# Altium schematic sheet Scratchpad.SchDoc (part 2 of 3)
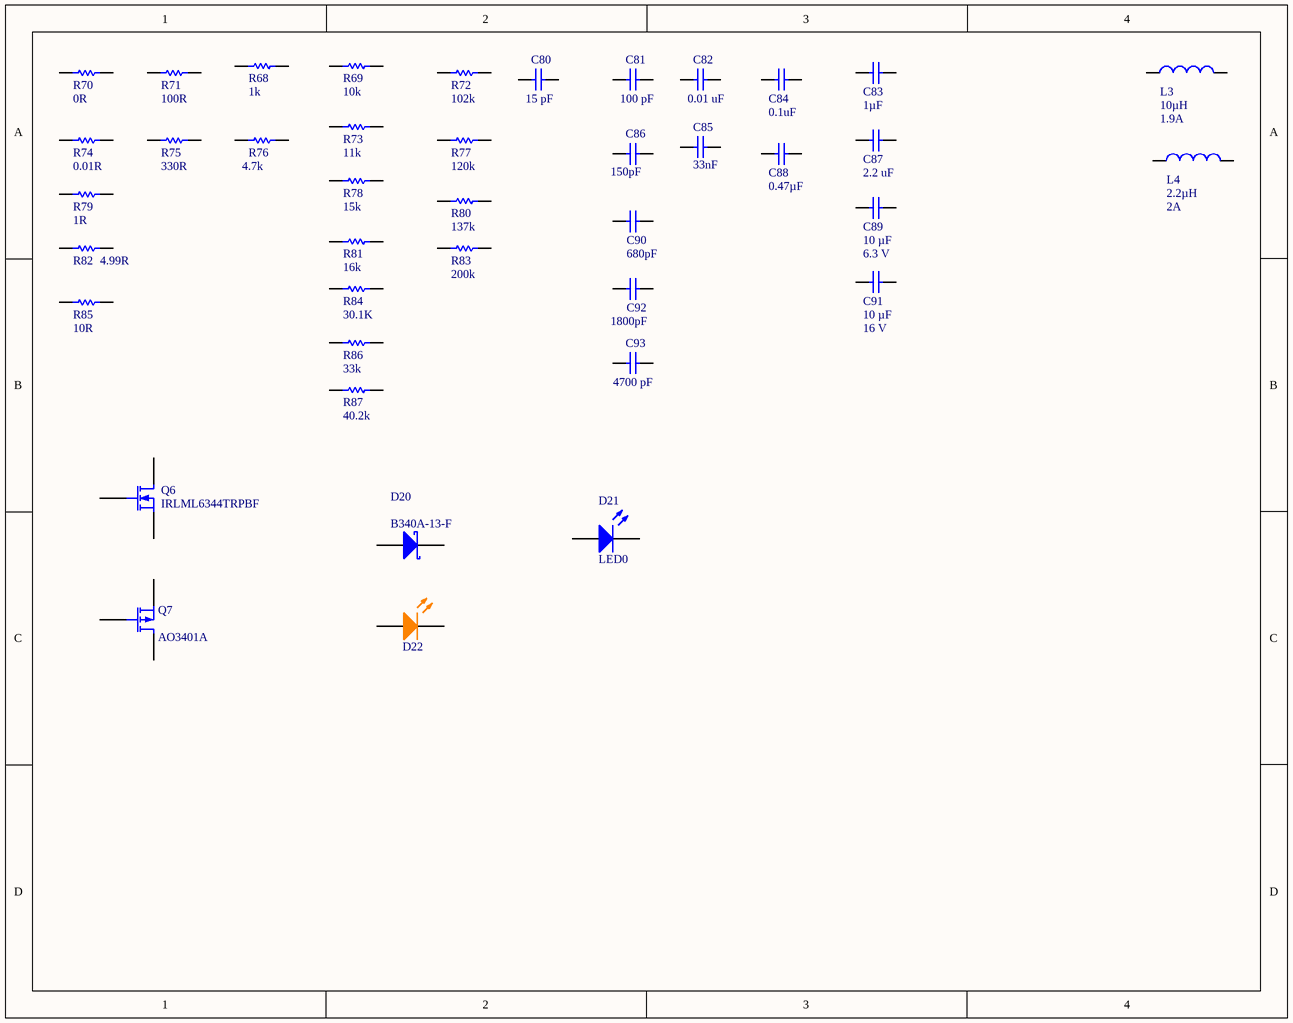
[diagram p1: Scratchpad.SchDoc]
## Library data of the parts
C80 = Cap: CAP .1UF 50V CERAMIC Y5V 0805; Manufacturer: Johanson; Manufacturer Part Number: 500R07N150JV4T; Description1: Cap Ceramic 15pF 50V C0G 5% SMD 0402 125C Paper T/R; Voltage Rating DC: 50 VDC; Dielectric: C0G (NP0); Tolerance: 5 %; Brand: Johanson Dielectrics; Type: Surface Mount MLCC; Revision: July-2002: Re-released for DXP Platform.; Supplier 1: Digi-Key; Supplier Part Number 1: 709-1118-1-ND; Stock 1: 100000; Pricing 1: 1=0.14, 10=0.103, 100=0.0458, 500=0.0327, 1000=0.0257, 2500=0.0233, 5000=0.0215 (USD); Product Category: Multilayer Ceramic Capacitors MLCC - SMD/SMT; RoHS: Details; Maximum Operating Temperature: + 125 C; Minimum Operating Temperature: - 55 C; Product: General Type MLCCs; Packaging: Reel; Factory Pack Quantity: 10000; ComponentLink1URL: https://datasheet.ciiva.com/26934/getdatasheetpartid-85139-26934162.pdf; ComponentLink1Description: https://datasheet.ciiva.com/26934/getdatasheetpartid-85139-26934162.pdf
C81 = Cap: CAP .1UF 50V CERAMIC Y5V 0805; Manufacturer: Kyocera AVX; Manufacturer Part Number: 04023C101KAT2A; Description1: Multilayer Ceramic Capacitors MLCC - SMD/SMT 0402 100pF 25volts X7R 10%; Dielectric: X7R; Tolerance (%): ±10 %; Rated Voltage: 25 V; Revision: July-2002: Re-released for DXP Platform.; Supplier 1: Digi-Key; Supplier Part Number 1: 478-10080-1-ND; Stock 1: 0; Pricing 1: 1=0.1, 10=0.041, 100=0.0183, 500=0.0131, 1000=0.0103, 2500=0.0093, 5000=0.0086 (USD); Case Size/Dimension: 0402; ComponentLink1URL: https://datasheet.ciiva.com/5416/cx7r-5416597.pdf; ComponentLink1Description: https://datasheet.ciiva.com/5416/cx7r-5416597.pdf; ComponentLink2URL: https://datasheet.ciiva.com/28453/1679506-28453671.pdf; ComponentLink2Description: https://datasheet.ciiva.com/28453/1679506-28453671.pdf; ComponentLink3URL: https://datasheet.ciiva.com/22619/1679506-22619705.pdf; ComponentLink3Description: https://datasheet.ciiva.com/22619/1679506-22619705.pdf; ComponentLink4URL: https://datasheet.ciiva.com/206/cx7r-206426.pdf; ComponentLink4Description: https://datasheet.ciiva.com/206/cx7r-206426.pdf; ComponentLink5URL: https://datasheet.ciiva.com/16397/cx7r-16397643.pdf; ComponentLink5Description: https://datasheet.ciiva.com/16397/cx7r-16397643.pdf; ComponentLink6URL: https://datasheet.ciiva.com/28586/1679506-28586543.pdf; ComponentLink6Description: https://datasheet.ciiva.com/28586/1679506-28586543.pdf
C82 = Cap: CAP .1UF 50V CERAMIC Y5V 0805; Manufacturer: American Technical Ceramics; Manufacturer Part Number: 520L103KT16T; Part # Aliases: 520L103KT ATC520L103KT ATC520L103KT16T; Description1: Multilayer Ceramic Capacitors MLCC - SMD/SMT 16volts 0.01uF 10%; Voltage Rating DC: 16 VDC; Dielectric: X7R; Tolerance: 10 %; Brand: American Technical Ceramics (ATC); Type: Broadband Multilayer Capacitor; Revision: July-2002: Re-released for DXP Platform.; Supplier 1: Digi-Key; Supplier Part Number 1: 1284-1540-1-ND; Stock 1: 206115; Pricing 1: 1=0.98, 10=0.748, 100=0.535 (USD); Product Category: Multilayer Ceramic Capacitors MLCC - SMD/SMT; RoHS: Details; Case Code - in: 0402; Case Code - mm: 1005; Maximum Operating Temperature: + 125 C; Minimum Operating Temperature: - 55 C; Product: RF Microwave / High Q; Series: 520L; Package / Case: 0402 (1005 metric); Packaging: Reel; Factory Pack Quantity: 1000; Termination Style: SMD/SMT; ComponentLink1URL: https://datasheet.ciiva.com/15214/getdatasheetpartid-566935-15214265.pdf; ComponentLink1Description: https://datasheet.ciiva.com/15214/getdatasheetpartid-566935-15214265.pdf; ComponentLink2URL: https://datasheet.ciiva.com/24070/520l-261941-24070397.pdf; ComponentLink2Description: https://datasheet.ciiva.com/24070/520l-261941-24070397.pdf
C83 = Cap: CAP .1UF 50V CERAMIC Y5V 0805; Manufacturer: TDK; Manufacturer Part Number: CGB2A1JB1C105K033BC; PCN Part Number: MLCC Part Number Change 30/Nov/2012; Description1: 1µF ±10% 16V JB Ceramic Capacitor -25°C ~ 85°C Surface Mount, MLCC 0402 (1005 Metric) 0.039" L x 0.020" W (1.00mm x 0.50mm); Product Training Modules: SEAT, CCV, and TVCL Design Tools Guide to Replacing an Electrolytic Capacitor with an MLCC; Featured Product: CGB Series Capacitors CH and JB Temperature Coefficient Capacitors; EDA / CAD Models: Download from Accelerated Designs; Tolerance: ±10%; Voltage - Rated: 16V; Temperature Coefficient: JB; Online Catalog: CGB Series; Other Names: 445-12011-6; Revision: July-2002: Re-released for DXP Platform.; Supplier 1: Digi-Key; Supplier Part Number 1: 445-12011-1-ND; Stock 1: 7430; Pricing 1: 1=0.22, 10=0.151, 100=0.0765, 500=0.0523, 1000=0.0463, 2500=0.0443, 5000=0.0403 (USD); RoHS Information: RoHS Certificate-MLCC; Standard Package: 1; Category: Capacitors; Family: Ceramic Capacitors; Series: CGB; Packaging: Digi-Reel®; Mounting Type: Surface Mount, MLCC; Operating Temperature: -25°C ~ 85°C; Applications: General Purpose; Package / Case: 0402 (1005 Metric); Size / Dimension: 0.039" L x 0.020" W (1.00mm x 0.50mm); Thickness (Max): 0.013" (0.33mm); Features: Low Profile; ComponentLink1URL: https://product.tdk.com/info/en/catalog/datasheets/mlcc_commercial_lowprofile_en.pdf; ComponentLink1Description: https://product.tdk.com/info/en/catalog/datasheets/mlcc_commercial_lowprofile_en.pdf; ComponentLink2URL: https://product.tdk.com/info/en/catalog/spec/mlccspec_commercial_lowprofile_en.pdf; ComponentLink2Description: https://product.tdk.com/info/en/catalog/spec/mlccspec_commercial_lowprofile_en.pdf; ComponentLink3URL: http://product.tdk.com/en/catalog/datasheets/mlcc_commercial_lowprofile_en.pdf; ComponentLink3Description: http://product.tdk.com/en/catalog/datasheets/mlcc_commercial_lowprofile_en.pdf
C84 = Cap: CAP .1UF 50V CERAMIC Y5V 0805; Manufacturer: Kyocera AVX; Manufacturer Part Number: 0402YD104KAT2A; Description1: AVX   0402YD104KAT2A   Multilayer Ceramic Capacitor, 0.1 F,  10%, X5R, 16 V, 0402 [1005 Metric]; Dielectric: X5R; Tolerance (%): ±10 %; Rated Voltage: 16 V; Revision: July-2002: Re-released for DXP Platform.; Supplier 1: Digi-Key; Supplier Part Number 1: 478-1126-1-ND; Stock 1: 0; Pricing 1: 1=0.1, 10=0.047, 100=0.0211, 500=0.0151, 1000=0.0119, 2500=0.0108, 5000=0.0099 (USD); Case Size/Dimension: 0402; ComponentLink1URL: https://datasheet.ciiva.com/2987/cx5r-2987712.pdf; ComponentLink1Description: https://datasheet.ciiva.com/2987/cx5r-2987712.pdf; ComponentLink2URL: https://datasheet.ciiva.com/150/cx5r-150353.pdf; ComponentLink2Description: https://datasheet.ciiva.com/150/cx5r-150353.pdf; ComponentLink3URL: https://datasheet.ciiva.com/150/cx5r-150354.pdf; ComponentLink3Description: https://datasheet.ciiva.com/150/cx5r-150354.pdf; ComponentLink4URL: https://datasheet.ciiva.com/11786/0900766b80def1a5-11786866.pdf; ComponentLink4Description: https://datasheet.ciiva.com/11786/0900766b80def1a5-11786866.pdf; ComponentLink5URL: https://datasheet.ciiva.com/150/cx5r-150355.pdf; ComponentLink5Description: https://datasheet.ciiva.com/150/cx5r-150355.pdf; ComponentLink6URL: https://datasheet.ciiva.com/1124/1666675-1124009.pdf; ComponentLink6Description: https://datasheet.ciiva.com/1124/1666675-1124009.pdf; ComponentLink7URL: https://datasheet.ciiva.com/5423/cx5r-33896-5423625.pdf; ComponentLink7Description: https://datasheet.ciiva.com/5423/cx5r-33896-5423625.pdf; ComponentLink8URL: https://datasheet.ciiva.com/1124/1666675-1124010.pdf; ComponentLink8Description: https://datasheet.ciiva.com/1124/1666675-1124010.pdf; ComponentLink9URL: https://datasheet.ciiva.com/14590/70001028-14590205.pdf; ComponentLink9Description: https://datasheet.ciiva.com/14590/70001028-14590205.pdf; ComponentLink10URL: https://datasheet.ciiva.com/14592/70001028-14592157.pdf; ComponentLink10Description: https://datasheet.ciiva.com/14592/70001028-14592157.pdf; ComponentLink11URL: https://datasheet.ciiva.com/16623/cx5r-16623293.pdf; ComponentLink11Description: https://datasheet.ciiva.com/16623/cx5r-16623293.pdf; ComponentLink12URL: https://datasheet.ciiva.com/34303/1928960-34303277.pdf; ComponentLink12Description: https://datasheet.ciiva.com/34303/1928960-34303277.pdf; ComponentLink13URL: https://datasheet.ciiva.com/2987/cx5r-2987711.pdf; ComponentLink13Description: https://datasheet.ciiva.com/2987/cx5r-2987711.pdf
C85 = Cap: CAP .1UF 50V CERAMIC Y5V 0805; Manufacturer: Samsung; Manufacturer Part Number: CL05F333ZO5NNNC; Description1: 0.033µF -20%, +80% 16V Y5V (F) Ceramic Capacitor -30°C ~ 85°C Surface Mount, MLCC 0402 (1005 Metric) 0.039" L x 0.020" W (1.00mm x 0.50mm); Rad Hard: No; Product Depth: 0.5 mm; Voltage: 16 Vdc; Tolerance: -20 to 80 %; Product Length: 1 mm; Revision: July-2002: Re-released for DXP Platform.; Supplier 1: Digi-Key; Supplier Part Number 1: 1276-1748-1-ND; Stock 1: 100000; Pricing 1: 1=0.1, 10=0.032, 100=0.0144, 500=0.0103, 1000=0.0081, 2500=0.0073, 5000=0.0068 (USD); Package/Case: 0402; Mounting: Surface Mount; Dielectric: Y5V; Operating Temperature: -30 to 85 °C; Construction: Flat; Product Height: 0.5 mm; Category: Capacitor Ceramic Multilayer; ComponentLink1URL: https://datasheet.ciiva.com/25718/cl05f333zo5nnnc-25718147.pdf; ComponentLink1Description: https://datasheet.ciiva.com/25718/cl05f333zo5nnnc-25718147.pdf
C86 = Cap: CAP .1UF 50V CERAMIC Y5V 0805; Manufacturer: Taiyo Yuden; Manufacturer Part Number: UMK105CH151JVHF; Revision: July-2002: Re-released for DXP Platform.; Supplier 1: Digi-Key; Supplier Part Number 1: 587-5071-1-ND; Stock 1: 10000; Pricing 1: 1=0.1, 10=0.056, 100=0.025, 500=0.0179, 1000=0.0141, 2500=0.0128, 5000=0.0118 (USD)
C87 = Cap: CAP .1UF 50V CERAMIC Y5V 0805; Manufacturer: Samsung; Manufacturer Part Number: CL05A225KO5NQNC; Description1: Cap Ceramic 2.2uF 16V X5R 10% SMD 0402 85C Cardboard T/R; Rad Hard: No; Product Depth: 0.5 mm; Voltage: 16 Vdc; Tolerance: 10 %; Dielectric: X5R; Product Length: 1 mm; Revision: July-2002: Re-released for DXP Platform.; Supplier 1: Digi-Key; Supplier Part Number 1: 1276-1461-1-ND; Stock 1: 100000; Pricing 1: 1=0.58, 10=0.41, 100=0.27, 500=0.2, 1000=0.17, 2500=0.16, 5000=0.15 (USD); Packaging: Tape & Reel; Package/Case: 0402; Mounting: Surface Mount; Operating Temperature: -55 to 85 °C; Construction: Flat; Product Height: 0.5 mm; Category: Capacitor Ceramic Multilayer; ComponentLink1URL: https://datasheet.ciiva.com/26838/getdatasheetpartid-357511-26838176.pdf; ComponentLink1Description: https://datasheet.ciiva.com/26838/getdatasheetpartid-357511-26838176.pdf; ComponentLink2URL: https://datasheet.ciiva.com/25724/cl05a225ko5nqnc-25724388.pdf; ComponentLink2Description: https://datasheet.ciiva.com/25724/cl05a225ko5nqnc-25724388.pdf
C88 = Cap: CAP .1UF 50V CERAMIC Y5V 0805; Manufacturer: Murata; Manufacturer Part Number: GRT155C81C474ME01D; Description1: 0.47µF 16V Ceramic Capacitor X6S 0402 (1005 Metric) 0.039" L x 0.020" W (1.00mm x 0.50mm); Tolerance: ±20%; Voltage - Rated: 16V; Temperature Coefficient: X6S; Revision: July-2002: Re-released for DXP Platform.; Supplier 1: Digi-Key; Supplier Part Number 1: 490-12244-1-ND; Stock 1: 25188; Pricing 1: 1=0.13, 10=0.096, 100=0.045, 500=0.0316, 1000=0.0262, 2500=0.0243, 5000=0.0223 (USD); Category: Capacitors; Family: Ceramic Capacitors; Series: GRT; Packaging: Tape & Reel (TR); Mounting Type: Surface Mount, MLCC; Operating Temperature: -55°C ~ 105°C; Applications: Automotive; Ratings: AEC-Q200; Package / Case: 0402 (1005 Metric); Size / Dimension: 0.039" L x 0.020" W (1.00mm x 0.50mm); Height - Seated (Max): -; Thickness (Max): 0.022" (0.55mm); Lead Spacing: -; Features: -; Lead Style: -; ComponentLink1URL: http://search.murata.co.jp/Ceramy/image/img/A01X/G101/ENG/GRT155C81C474ME01-01.pdf; ComponentLink1Description: http://search.murata.co.jp/Ceramy/image/img/A01X/G101/ENG/GRT155C81C474ME01-01.pdf
C89 = Cap: CAP .1UF 50V CERAMIC Y5V 0805; Manufacturer: Samsung; Manufacturer Part Number: CL10B106MQ8NRNC; Description1: 10µF ±20% 6.3V X7R Ceramic Capacitor -55°C ~ 125°C Surface Mount, MLCC 0603 (1608 Metric) 0.063" L x 0.031" W (1.60mm x 0.80mm); Dielectric: X7R; Tolerance (%): ±20 %; Revision: July-2002: Re-released for DXP Platform.; Supplier 1: Digi-Key; Supplier Part Number 1: 1276-1948-1-ND; Stock 1: 40000; Pricing 1: 1=1.07, 10=0.813, 100=0.5813, 500=0.45, 1000=0.3875 (USD); Case Size/Dimension: 0603; ComponentLink1URL: https://datasheet.ciiva.com/25723/cl10b106mq8nrnc-25723233.pdf; ComponentLink1Description: https://datasheet.ciiva.com/25723/cl10b106mq8nrnc-25723233.pdf; ComponentLink2URL: https://datasheet.ciiva.com/16428/cl10b106mq8nrnc-16428858.pdf; ComponentLink2Description: https://datasheet.ciiva.com/16428/cl10b106mq8nrnc-16428858.pdf
C90 = Cap: CAP .1UF 50V CERAMIC Y5V 0805; Manufacturer: Murata; Manufacturer Part Number: GRM1555C1E681JA01D; Description1: Multilayer Ceramic Capacitors MLCC - SMD/SMT 680pF 25Volts C0G 5%; Catalog Drawings: GRM Series_0402; Voltage - Rated: 25V; Tolerance: ±5%; Temperature Coefficient: C0G, NP0; Dynamic Catalog: GRM Series; Other Names: 490-6182-6; Revision: July-2002: Re-released for DXP Platform.; Supplier 1: Digi-Key; Supplier Part Number 1: 490-6182-1-ND; Stock 1: 100000; Pricing 1: 1=0.13, 10=0.097, 100=0.043, 500=0.0307, 1000=0.0241, 2500=0.0219, 5000=0.0202 (USD); Standard Package: 1; Category: Capacitors; Family: Ceramic Capacitors; Series: GRM; Mounting Type: Surface Mount, MLCC; Operating Temperature: -55°C ~ 125°C; Applications: General Purpose; Package / Case: 0402 (1005 Metric); Size / Dimension: 0.039" L x 0.020" W (1.00mm x 0.50mm); Thickness (Max): 0.022" (0.55mm); Packaging: Digi-Reel®; ComponentLink1URL: https://datasheet.ciiva.com/11604/product-11604196.pdf; ComponentLink1Description: https://datasheet.ciiva.com/11604/product-11604196.pdf; ComponentLink2URL: https://datasheet.ciiva.com/6270/partnumbering-e-01-6270729.pdf; ComponentLink2Description: https://datasheet.ciiva.com/6270/partnumbering-e-01-6270729.pdf; ComponentLink3URL: https://datasheet.ciiva.com/6270/partnumbering-e-01-6270730.pdf; ComponentLink3Description: https://datasheet.ciiva.com/6270/partnumbering-e-01-6270730.pdf; ComponentLink4URL: https://datasheet.ciiva.com/6270/partnumbering-e-01-6270731.pdf; ComponentLink4Description: https://datasheet.ciiva.com/6270/partnumbering-e-01-6270731.pdf
C91 = Cap: CAP .1UF 50V CERAMIC Y5V 0805; Manufacturer: Murata; Manufacturer Part Number: GRM31CR71C106KA12L; Description1: MURATA   GRM31CR71C106KA12L   SMD Multilayer Ceramic Capacitor, 10 F,  10%, X7R, 16 V, 1206 [3216 Metric]; Tolerance: 10 %; Material properties: X7R; Content: 1 pc(s); Type: SMD; Revision: July-2002: Re-released for DXP Platform.; Supplier 1: Digi-Key; Supplier Part Number 1: 490-10526-2-ND; Stock 1: 0; Pricing 1: 2000=0.08 (USD); Category: Ceramic capacitor; Material: Ceramic; ComponentLink1URL: https://datasheet.ciiva.com/22774/608985-22774038.pdf; ComponentLink1Description: https://datasheet.ciiva.com/22774/608985-22774038.pdf; ComponentLink2URL: https://datasheet.ciiva.com/17454/c02e-17454536.pdf; ComponentLink2Description: https://datasheet.ciiva.com/17454/c02e-17454536.pdf; ComponentLink3URL: https://datasheet.ciiva.com/11607/c02e-11607499.pdf; ComponentLink3Description: https://datasheet.ciiva.com/11607/c02e-11607499.pdf; ComponentLink4URL: https://datasheet.ciiva.com/18697/c02e-18697819.pdf; ComponentLink4Description: https://datasheet.ciiva.com/18697/c02e-18697819.pdf; ComponentLink5URL: https://datasheet.ciiva.com/7937/608985-7937740.pdf; ComponentLink5Description: https://datasheet.ciiva.com/7937/608985-7937740.pdf; ComponentLink6URL: https://datasheet.ciiva.com/18697/c02e-18697820.pdf; ComponentLink6Description: https://datasheet.ciiva.com/18697/c02e-18697820.pdf; ComponentLink7URL: https://datasheet.ciiva.com/18697/c02e-18697821.pdf; ComponentLink7Description: https://datasheet.ciiva.com/18697/c02e-18697821.pdf; ComponentLink8URL: https://datasheet.ciiva.com/29202/451342-da-01-de-vs-kondens-grm31-cr71c-106ka12l-29202404.pdf; ComponentLink8Description: https://datasheet.ciiva.com/29202/451342-da-01-de-vs-kondens-grm31-cr71c-106ka12l-29202404.pdf; ComponentLink9URL: https://datasheet.ciiva.com/29202/450988-da-01-de-vs-chip-kond-1206-10-0-uf-10pr-16-0v-x7r-29202582.pdf; ComponentLink9Description: https://datasheet.ciiva.com/29202/450988-da-01-de-vs-chip-kond-1206-10-0-uf-10pr-16-0v-x7r-29202582.pdf
C92 = Cap: CAP .1UF 50V CERAMIC Y5V 0805; Manufacturer: Panasonic; Manufacturer Part Number: ERJ-2RKF4022X; Description1: Res Thick Film 0402 40.2K Ohm 1% 0.1W(1/10W) ±100ppm/C Molded SMD Automotive T/R; Resistor Element Type: Thick Film; Product Range: PANASONIC - ERJ Series; Resistance: 40.2kohm; Power Rating: 100mW; Resistance Tolerance: ± 1%; Resistor Case Style: 0402 [1005 Metric]; Temperature Coefficient: ± 100ppm/°C; SVHC: Diboron trioxide (19-Dec-2012); Resistor Mounting: SMD; SVHC (Secondary): Lead monoxide (lead oxide) (19-Dec-2012); Revision: July-2002: Re-released for DXP Platform.; Supplier 1: Digi-Key; Supplier Part Number 1: P40.2KLCT-ND; Stock 1: 987602; Pricing 1: 1=0.1, 10=0.056, 100=0.0227, 1000=0.0102, 2500=0.0089, 5000=0.0073 (USD); Resistor Element Material: Thick Film; Voltage Rating: 50V; Packaging: Cut Tape; MSL: (Not Applicable); ComponentLink1URL: https://datasheet.ciiva.com/6159/426256-6159589.pdf; ComponentLink1Description: https://datasheet.ciiva.com/6159/426256-6159589.pdf; ComponentLink2URL: https://datasheet.ciiva.com/16786/70260748-16786006.pdf; ComponentLink2Description: https://datasheet.ciiva.com/16786/70260748-16786006.pdf; ComponentLink3URL: https://datasheet.ciiva.com/27055/1987281-27055654.pdf; ComponentLink3Description: https://datasheet.ciiva.com/27055/1987281-27055654.pdf; ComponentLink4URL: https://datasheet.ciiva.com/28693/1678782-28693542.pdf; ComponentLink4Description: https://datasheet.ciiva.com/28693/1678782-28693542.pdf; ComponentLink5URL: https://datasheet.ciiva.com/16771/70260748-16771239.pdf; ComponentLink5Description: https://datasheet.ciiva.com/16771/70260748-16771239.pdf; ComponentLink6URL: https://datasheet.ciiva.com/9189/aoa0000ce2-9189864.pdf; ComponentLink6Description: https://datasheet.ciiva.com/9189/aoa0000ce2-9189864.pdf; ComponentLink7URL: https://datasheet.ciiva.com/43460/426256-43460328.pdf; ComponentLink7Description: https://datasheet.ciiva.com/43460/426256-43460328.pdf; ComponentLink8URL: https://datasheet.ciiva.com/46377/426256-46377274.pdf; ComponentLink8Description: https://datasheet.ciiva.com/46377/426256-46377274.pdf; ComponentLink9URL: https://datasheet.ciiva.com/24160/aoa0000ce2-24160028.pdf; ComponentLink9Description: https://datasheet.ciiva.com/24160/aoa0000ce2-24160028.pdf
C93 = Cap: CAP .1UF 50V CERAMIC Y5V 0805; Manufacturer: Murata; Manufacturer Part Number: GCM155R71H472KA37D; Description1: CAP CER 4700PF 50V X7R 0402; Dielectric: X7R; Tolerance (%): ±10 %; Revision: July-2002: Re-released for DXP Platform.; Supplier 1: Digi-Key; Supplier Part Number 1: 490-4915-1-ND; Stock 1: 100000; Pricing 1: 1=0.1, 10=0.047, 100=0.021, 500=0.015, 1000=0.0118, 2500=0.0107, 5000=0.0099 (USD); Case Size/Dimension: 0402; Rated Voltage: 50 V; ComponentLink1URL: https://datasheet.ciiva.com/26843/getdatasheetpartid-724237-26843665.pdf; ComponentLink1Description: https://datasheet.ciiva.com/26843/getdatasheetpartid-724237-26843665.pdf; ComponentLink2URL: https://datasheet.ciiva.com/17453/product-17453667.pdf; ComponentLink2Description: https://datasheet.ciiva.com/17453/product-17453667.pdf; ComponentLink3URL: https://datasheet.ciiva.com/2989/product-2989236.pdf; ComponentLink3Description: https://datasheet.ciiva.com/2989/product-2989236.pdf; ComponentLink4URL: https://datasheet.ciiva.com/155/product-155869.pdf; ComponentLink4Description: https://datasheet.ciiva.com/155/product-155869.pdf; ComponentLink5URL: https://datasheet.ciiva.com/16440/product-16440397.pdf; ComponentLink5Description: https://datasheet.ciiva.com/16440/product-16440397.pdf; ComponentLink6URL: https://datasheet.ciiva.com/155/product-155870.pdf; ComponentLink6Description: https://datasheet.ciiva.com/155/product-155870.pdf; ComponentLink7URL: https://datasheet.ciiva.com/155/product-155871.pdf; ComponentLink7Description: https://datasheet.ciiva.com/155/product-155871.pdf
D20 = BAT46ZFILM: Schottky Rectifier; Manufacturer: Diodes Incorporated; Description1: DIODE SCHOTTKY 40V 3A SMA; Voltage - DC Reverse (Vr) (Max): 40V; Current - Average Rectified (Io): 3A; Voltage - Forward (Vf) (Max) @ If: 500mV @ 3A; Speed: Fast Recovery =< 500ns, > 200mA (Io); Current - Reverse Leakage @ Vr: 500µA @ 40V; Capacitance @ Vr, F: 200pF @ 4V, 1MHz; Supplier 1: Digi-Key; Supplier Part Number 1: B340A-FDICT-ND; RoHS: RoHS Compliant; Category: Discrete Semiconductor Products; Stock 1: 304487; Pricing 1: 1=0.42, 10=0.339, 100=0.231, 500=0.1729, 1000=0.1295 (USD); Packaging: Cut Tape (CT); Part Status: Active; Diode Type: Schottky; Reverse Recovery Time (trr): -; Mounting Type: Surface Mount; Package / Case: DO-214AC, SMA; Supplier Device Package: SMA; Operating Temperature - Junction: -55°C ~ 150°C; ComponentLink1URL: http://www.diodes.com/_files/datasheets/ds30891.pdf; ComponentLink1Description: http://www.diodes.com/_files/datasheets/ds30891.pdf
D21 = LED0: Typical INFRARED GaAs LED; Published: 8-Jun-2000; LatestRevisionDate: 08-Jul-2005; LatestRevisionNote: Mech Layer 1 removed.; PackageReference: LED-0; Publisher: Altium Limited; PackageDescription: LED; 2 Leads
D22 = LED0_1: Typical INFRARED GaAs LED; Manufacturer: Vishay; Manufacturer Part Number: VLMO1500-GS08; Description1: Standard LEDs - SMD 0402 SOFT ORANGE Non-Diff; Illumination Color: Orange; Wavelength/Color Temperature: 605 nm; Luminous Intensity: 90 mcd; Viewing Angle: 130 deg; Lens Color/Style: Water Clear; If - Forward Current: 30 mA; Vf - Forward Voltage: 2 V; Power Rating: 75 mW; Brand: Vishay Semiconductors; Supplier 1: Digi-Key; Supplier Part Number 1: VLMO1500-GS08CT-ND; Stock 1: 194938; Pricing 1: 1=0.53, 10=0.38, 25=0.2916, 100=0.1901, 250=0.1394, 500=0.1183, 1000=0.0972 (USD); Product Category: Standard LEDs - SMD; RoHS: True; Package / Case: 0402 (1005 metric); Length: 1 mm; Height: 0.35 mm; Width: 0.5 mm; Minimum Operating Temperature: - 30 C; Maximum Operating Temperature: + 85 C; Series: VLMx; Packaging: Reel; Mounting Style: SMD/SMT; Factory Pack Quantity: 9000; Tradename: ChipLED; ComponentLink1URL: https://datasheet.ciiva.com/13945/vlmo1500-13945355.pdf; ComponentLink1Description: https://datasheet.ciiva.com/13945/vlmo1500-13945355.pdf; ComponentLink2URL: https://datasheet.ciiva.com/13945/vlmo1500-13945356.pdf; ComponentLink2Description: https://datasheet.ciiva.com/13945/vlmo1500-13945356.pdf; ComponentLink3URL: https://datasheet.ciiva.com/13945/vlmo1500-13945357.pdf; ComponentLink3Description: https://datasheet.ciiva.com/13945/vlmo1500-13945357.pdf
L3 = Inductor: Manufacturer: Taiyo Yuden; Description1: FIXED IND 10UH 1.9A 84.5 MOHM; Product Training Modules: EMC Applications NR Series of RF Inductors; Catalog Drawings: NR60(12,20,28,45),NRS6010 Series Bottom NR60(12,20,28,45),NRS6010 Series Top NR(S)6028 Series Side; Featured Product: NR Series Inductors; EDA / CAD Models: Download from Accelerated Designs; Type: Wirewound; Material - Core: Ferrite; Tolerance: ±20%; Shielding: Shielded; DC Resistance (DCR): 84.5 mOhm Max; Frequency - Self Resonant: 20MHz; Frequency - Test: 100kHz; Online Catalog: NR, NRH and NRS Series; Other Names: 587-2102-2 / LM NR 6028T 100M; Supplier 1: Digi-Key; Supplier Part Number 1: 587-2102-1-ND; Manufacturer Part Number: NR6028T100M; Stock 1: 165015; Pricing 1: 1=0.36, 10=0.317, 100=0.2182, 500=0.1865, 1000=0.1428 (USD); Standard Package: 2,000; Category: Inductors, Coils, Chokes; Family: Fixed Inductors; Series: NR; Packaging: Tape & Reel (TR); Current Rating: 1.9A; Operating Temperature: -25°C ~ 120°C; Mounting Type: Surface Mount; Package / Case: Nonstandard; Size / Dimension: 0.236" L x 0.236" W (6.00mm x 6.00mm); Height - Seated (Max): 0.110" (2.80mm); ComponentLink1URL: https://datasheet.ciiva.com/22624/1697191-22624161.pdf; ComponentLink1Description: https://datasheet.ciiva.com/22624/1697191-22624161.pdf; ComponentLink2URL: https://datasheet.ciiva.com/5763/nr6028t100m-ss-5763922.pdf; ComponentLink2Description: https://datasheet.ciiva.com/5763/nr6028t100m-ss-5763922.pdf; ComponentLink3URL: https://datasheet.ciiva.com/8505/nr6028t100m-ss-8505657.pdf; ComponentLink3Description: https://datasheet.ciiva.com/8505/nr6028t100m-ss-8505657.pdf; ComponentLink4URL: https://datasheet.ciiva.com/15988/250nr6028t100m-15988057.pdf; ComponentLink4Description: https://datasheet.ciiva.com/15988/250nr6028t100m-15988057.pdf; ComponentLink5URL: https://datasheet.ciiva.com/4958/wound04-e-4958924.pdf; ComponentLink5Description: https://datasheet.ciiva.com/4958/wound04-e-4958924.pdf; ComponentLink6URL: https://datasheet.ciiva.com/1043/wound04-e-1043069.pdf; ComponentLink6Description: https://datasheet.ciiva.com/1043/wound04-e-1043069.pdf; ComponentLink7URL: https://datasheet.ciiva.com/1043/wound04-e-1043070.pdf; ComponentLink7Description: https://datasheet.ciiva.com/1043/wound04-e-1043070.pdf; ComponentLink8URL: https://datasheet.ciiva.com/1043/wound04-e-1043071.pdf; ComponentLink8Description: https://datasheet.ciiva.com/1043/wound04-e-1043071.pdf
L4 = Inductor: Manufacturer: TDK; Manufacturer Part Number: VLF4014ST-2R2M1R9; Description1: FIXED IND 2.2UH 1.9A 72 MOHM SMD; Catalog Drawings: VLF401(2,4)S Series Top VLF4014S Series Side VLF401(2,4)S Series Footprint; EDA / CAD Models: Download from Accelerated Designs; Type: Wirewound; Material - Core: Ferrite; Tolerance: ±20%; Current Rating: 1.9A; Shielding: Shielded; DC Resistance (DCR): 72 mOhm Max; Frequency - Test: 1MHz; Online Catalog: VLF Series; Other Names: 445-4220-6; Supplier 1: Digi-Key; Supplier Part Number 1: 445-4220-1-ND; Stock 1: 7117; Pricing 1: 1=0.96, 10=0.837, 100=0.598, 500=0.5023 (USD); Standard Package: 1; Category: Inductors, Coils, Chokes; Family: Fixed Inductors; Series: VLF; Packaging: Digi-Reel®; Operating Temperature: -40°C ~ 105°C; Mounting Type: Surface Mount; Package / Case: Nonstandard; Size / Dimension: 0.150" L x 0.142" W (3.80mm x 3.60mm); Height - Seated (Max): 0.055" (1.40mm); ComponentLink1URL: https://datasheet.ciiva.com/1046/vlf4014s-1046567.pdf; ComponentLink1Description: https://datasheet.ciiva.com/1046/vlf4014s-1046567.pdf; ComponentLink2URL: https://datasheet.ciiva.com/1046/vlf4014s-1046568.pdf; ComponentLink2Description: https://datasheet.ciiva.com/1046/vlf4014s-1046568.pdf; ComponentLink3URL: https://datasheet.ciiva.com/1046/vlf4014s-1046569.pdf; ComponentLink3Description: https://datasheet.ciiva.com/1046/vlf4014s-1046569.pdf
Q6 = MOSFET-N: N-Channel MOSFET; Manufacturer: Infineon; Description1: INFINEON         IRLML6344TRPBF             MOSFET Transistor, N Channel, 5 A, 30 V, 22 mohm, 4.5 V, 800 mV; FET Type: MOSFET N-Channel, Metal Oxide; FET Feature: Standard; Drain to Source Voltage (Vdss): 30V; Current - Continuous Drain (Id) @ 25°C: 5A (Ta); Rds On (Max) @ Id, Vgs: 29 mOhm @ 5A, 4.5V; Vgs(th) (Max) @ Id: 1.1V @ 10µA; Gate Charge (Qg) @ Vgs: 6.8nC @ 4.5V; Input Capacitance (Ciss) @ Vds: 650pF @ 25V; Power - Max: 1.3W; Supplier 1: Digi-Key; Supplier Part Number 1: IRLML6344TRPBFDKR-ND; Stock 1: 307324; Pricing 1: 1=0.54, 10=0.42, 100=0.2881, 500=0.1976, 1000=0.1482 (USD); Category: Discrete Semiconductor Products; Family: Transistors - FETs, MOSFETs - Single; Series: HEXFET®; Packaging: Tape & Reel (TR); Part Status: Active; Operating Temperature: -55°C ~ 150°C (TJ); Mounting Type: Surface Mount; Package / Case: TO-236-3, SC-59, SOT-23-3; Supplier Device Package: Micro3™/SOT-23; ComponentLink1URL: https://www.infineon.com/dgdl/irlml6344pbf.pdf?fileId=5546d462533600a4015356689c44262c; ComponentLink1Description: https://www.infineon.com/dgdl/irlml6344pbf.pdf?fileId=5546d462533600a4015356689c44262c; ComponentLink2URL: http://www.farnell.com/datasheets/1911844.pdf; ComponentLink2Description: http://www.farnell.com/datasheets/1911844.pdf; ComponentLink3URL: http://www.infineon.com/dgdl/irlml6344pbf.pdf?fileId=5546d462533600a4015356689c44262c; ComponentLink3Description: http://www.infineon.com/dgdl/irlml6344pbf.pdf?fileId=5546d462533600a4015356689c44262c
Q7 = MOSFET-P: P-Channel MOSFET; Manufacturer: Alpha & Omega Semiconductor; Description1: MOSFET P-CH 30V 4A SOT23; Channel Mode: Enhancement; Continuous Drain Current: 4 A; Drain Efficiency: Not Required %; Drain-Source On-Res: 0.044 ohm; Drain-Source On-Volt: 30 V; Frequency (Max): Not Required MHz; Gate-Source Voltage (Max): ?12 V; Noise Figure: Not Required dB; Number of  Elements: 1; Output Power (Max): Not Required W; Polarity: P; Power Dissipation: 1.4 W; Rad Hardened: No; Type: Power MOSFET; Supplier 1: Digi-Key; Supplier Part Number 1: 785-1001-6-ND; Stock 1: 271450; Pricing 1: 1=0.51, 10=0.357, 100=0.2345, 500=0.1386, 1000=0.1066 (USD); Drain Current (Max): 4 A; Mounting: Surface Mount; Operating Temp Range: -55C to 150C; Operating Temperature Classification: Military; Package Type: SOT-23; Pin Count: 3; Power Gain: Not Required dB; ComponentLink1URL: https://datasheet.ciiva.com/940/ao3401a-940720.pdf; ComponentLink1Description: https://datasheet.ciiva.com/940/ao3401a-940720.pdf; ComponentLink2URL: https://datasheet.ciiva.com/26927/getdatasheetpartid-79048-26927888.pdf; ComponentLink2Description: https://datasheet.ciiva.com/26927/getdatasheetpartid-79048-26927888.pdf
R68 = Res 0805: Resistor; Manufacturer: Panasonic; Manufacturer Part Number: ERJ-3EKF1001V; Description1: Res Thick Film 0603 1K Ohm 1% 0.1W(1/10W) ±100ppm/C Molded SMD Automotive Punched T/R; EDA / CAD Models: Download from Accelerated Designs; Tolerance: ±1%; Power (Watts): 0.1W, 1/10W; Temperature Coefficient: ±100ppm/°C; Online Catalog: ERJ Series; Kits: RSM3H-ND  - RES KIT 1K-9.76K 1/10W 4800PCS; Other Names: ERJ-3EKF1001 ERJ3EKF1001 P1.00KHCT; Supplier 1: Digi-Key; Supplier Part Number 1: P1.00KHCT-ND; Stock 1: 15998242; Pricing 1: 1=0.1, 10=0.079, 100=0.0323, 1000=0.0145, 2500=0.0126 (USD); Standard Package: 1; Category: Resistors; Family: Chip Resistor - Surface Mount; Series: ERJ; Packaging: Cut Tape (CT); Composition: Thick Film; Features: Automotive AEC-Q200; Operating Temperature: -55°C ~ 155°C; Package / Case: 0603 (1608 Metric); Supplier Device Package: 0603; Size / Dimension: 0.063" L x 0.031" W (1.60mm x 0.80mm); Height: 0.022" (0.55mm); Number of Terminations: 2; ComponentLink1URL: https://datasheet.ciiva.com/16768/70260748-16768437.pdf; ComponentLink1Description: https://datasheet.ciiva.com/16768/70260748-16768437.pdf; ComponentLink2URL: https://datasheet.ciiva.com/16774/70260748-16774550.pdf; ComponentLink2Description: https://datasheet.ciiva.com/16774/70260748-16774550.pdf; ComponentLink3URL: https://datasheet.ciiva.com/28532/426256-28532120.pdf; ComponentLink3Description: https://datasheet.ciiva.com/28532/426256-28532120.pdf; ComponentLink4URL: https://datasheet.ciiva.com/16449/aoa0000ce2-16449065.pdf; ComponentLink4Description: https://datasheet.ciiva.com/16449/aoa0000ce2-16449065.pdf; ComponentLink5URL: https://datasheet.ciiva.com/7942/aoa0000ce2-7942427.pdf; ComponentLink5Description: https://datasheet.ciiva.com/7942/aoa0000ce2-7942427.pdf; ComponentLink6URL: https://datasheet.ciiva.com/9198/aoa0000ce2-9198923.pdf; ComponentLink6Description: https://datasheet.ciiva.com/9198/aoa0000ce2-9198923.pdf; ComponentLink7URL: https://datasheet.ciiva.com/46373/1678782-46373339.pdf; ComponentLink7Description: https://datasheet.ciiva.com/46373/1678782-46373339.pdf; ComponentLink8URL: https://datasheet.ciiva.com/48530/aoa0000ce2-48530987.pdf; ComponentLink8Description: https://datasheet.ciiva.com/48530/aoa0000ce2-48530987.pdf; ComponentLink9URL: https://datasheet.ciiva.com/46373/1678782-46373340.pdf; ComponentLink9Description: https://datasheet.ciiva.com/46373/1678782-46373340.pdf; ComponentLink10URL: https://datasheet.ciiva.com/24070/aoa0000ce2-24070269.pdf; ComponentLink10Description: https://datasheet.ciiva.com/24070/aoa0000ce2-24070269.pdf; ComponentLink11URL: https://datasheet.ciiva.com/22673/1678782-22673918.pdf; ComponentLink11Description: https://datasheet.ciiva.com/22673/1678782-22673918.pdf; ComponentLink12URL: https://datasheet.ciiva.com/30063/aoa0000ce2-30063390.pdf; ComponentLink12Description: https://datasheet.ciiva.com/30063/aoa0000ce2-30063390.pdf; ComponentLink13URL: https://datasheet.ciiva.com/17215/aoa0000ce2-17215311.pdf; ComponentLink13Description: https://datasheet.ciiva.com/17215/aoa0000ce2-17215311.pdf
R69 = Res 0805: Resistor; Manufacturer: Samsung; Manufacturer Part Number: RC1005F103CS; Description1: Res Thick Film 0402 10K Ohm 1% 0.063W(1/16W) ±100ppm/C Molded SMD T/R; Rated Power: 0.063 W; Tolerance (%): ±1 %; Temp Coefficient: ±100 ppm/°C; Supplier 1: Digi-Key; Supplier Part Number 1: 1276-3431-1-ND; Stock 1: 15935883; Pricing 1: 1=0.1, 10=0.021, 100=0.0087, 1000=0.0039, 2500=0.0034, 5000=0.0028 (USD); Size Code: 0402; ComponentLink1URL: https://datasheet.ciiva.com/15196/getdatasheetpartid-504789-15196214.pdf; ComponentLink1Description: https://datasheet.ciiva.com/15196/getdatasheetpartid-504789-15196214.pdf; ComponentLink2URL: https://datasheet.ciiva.com/16481/rcseries-16481007.pdf; ComponentLink2Description: https://datasheet.ciiva.com/16481/rcseries-16481007.pdf
R70 = Res 0805: Resistor; Manufacturer: Panasonic; Manufacturer Part Number: ERJ-2GE0R00X; Description1: Res Thick Film 0402 0 Ohm Molded SMD Automotive T/R; EDA / CAD Models: Download from Accelerated Designs; Tolerance: Jumper; Power (Watts): 0.1W, 1/10W; Online Catalog: ERJ Series; Other Names: P0.0JDKR; Supplier 1: Digi-Key; Supplier Part Number 1: P0.0JCT-ND; Stock 1: 31263960; Pricing 1: 1=0.1, 10=0.037, 25=0.0268, 50=0.0204, 100=0.015, 250=0.0114, 500=0.0091, 1000=0.0067, 5000=0.0048 (USD); Standard Package: 1; Category: Resistors; Family: Chip Resistor - Surface Mount; Series: ERJ; Packaging: Digi-Reel®; Composition: Thick Film; Features: Automotive AEC-Q200; Temperature Coefficient: -; Operating Temperature: -55°C ~ 155°C; Package / Case: 0402 (1005 Metric); Supplier Device Package: 0402; Size / Dimension: 0.039" L x 0.020" W (1.00mm x 0.50mm); Height: 0.016" (0.40mm); Number of Terminations: 2; ComponentLink1URL: https://datasheet.ciiva.com/48531/aoa0000ce1-48531077.pdf; ComponentLink1Description: https://datasheet.ciiva.com/48531/aoa0000ce1-48531077.pdf; ComponentLink2URL: https://datasheet.ciiva.com/16783/70260739-16783734.pdf; ComponentLink2Description: https://datasheet.ciiva.com/16783/70260739-16783734.pdf; ComponentLink3URL: https://datasheet.ciiva.com/11821/0900766b80f806dd-11821176.pdf; ComponentLink3Description: https://datasheet.ciiva.com/11821/0900766b80f806dd-11821176.pdf; ComponentLink4URL: https://datasheet.ciiva.com/17215/aoa0000ce1-17215386.pdf; ComponentLink4Description: https://datasheet.ciiva.com/17215/aoa0000ce1-17215386.pdf; ComponentLink5URL: https://datasheet.ciiva.com/43460/1678796-43460347.pdf; ComponentLink5Description: https://datasheet.ciiva.com/43460/1678796-43460347.pdf; ComponentLink6URL: https://datasheet.ciiva.com/5959/1678796-5959692.pdf; ComponentLink6Description: https://datasheet.ciiva.com/5959/1678796-5959692.pdf; ComponentLink7URL: https://datasheet.ciiva.com/30097/4aoa0000ce1-30097116.pdf; ComponentLink7Description: https://datasheet.ciiva.com/30097/4aoa0000ce1-30097116.pdf; ComponentLink8URL: https://datasheet.ciiva.com/28695/1678796-28695758.pdf; ComponentLink8Description: https://datasheet.ciiva.com/28695/1678796-28695758.pdf; ComponentLink9URL: https://datasheet.ciiva.com/46389/1678796-46389518.pdf; ComponentLink9Description: https://datasheet.ciiva.com/46389/1678796-46389518.pdf; ComponentLink10URL: https://datasheet.ciiva.com/16778/70260739-16778335.pdf; ComponentLink10Description: https://datasheet.ciiva.com/16778/70260739-16778335.pdf
R71 = Res 0805: Resistor; Manufacturer: Panasonic; Manufacturer Part Number: ERJ-2RKF1000X; Description1: Res Thick Film 0402 100 Ohm 1% 0.1W(1/10W) ±100ppm/C Molded SMD Automotive T/R; Rated Power: 0.1 W; Tolerance (%): ±1 %; Temp Coefficient: ±100 ppm/°C; Supplier 1: Digi-Key; Supplier Part Number 1: P100LCT-ND; Stock 1: 14075966; Pricing 1: 1=0.1, 10=0.056, 100=0.0227, 1000=0.0102, 2500=0.0089, 5000=0.0073 (USD); Size Code: 0402; ComponentLink1URL: https://datasheet.ciiva.com/27056/2007311-27056035.pdf; ComponentLink1Description: https://datasheet.ciiva.com/27056/2007311-27056035.pdf; ComponentLink2URL: https://datasheet.ciiva.com/11821/0900766b80f80784-11821173.pdf; ComponentLink2Description: https://datasheet.ciiva.com/11821/0900766b80f80784-11821173.pdf; ComponentLink3URL: https://datasheet.ciiva.com/46372/1678782-46372741.pdf; ComponentLink3Description: https://datasheet.ciiva.com/46372/1678782-46372741.pdf; ComponentLink4URL: https://datasheet.ciiva.com/16199/aoa0000ce2-16199575.pdf; ComponentLink4Description: https://datasheet.ciiva.com/16199/aoa0000ce2-16199575.pdf; ComponentLink5URL: https://datasheet.ciiva.com/43467/1678782-43467223.pdf; ComponentLink5Description: https://datasheet.ciiva.com/43467/1678782-43467223.pdf; ComponentLink6URL: https://datasheet.ciiva.com/30260/aoa0000ce2-30260809.pdf; ComponentLink6Description: https://datasheet.ciiva.com/30260/aoa0000ce2-30260809.pdf; ComponentLink7URL: https://datasheet.ciiva.com/9186/aoa0000ce2-9186683.pdf; ComponentLink7Description: https://datasheet.ciiva.com/9186/aoa0000ce2-9186683.pdf; ComponentLink8URL: https://datasheet.ciiva.com/16776/70260748-16776427.pdf; ComponentLink8Description: https://datasheet.ciiva.com/16776/70260748-16776427.pdf; ComponentLink9URL: https://datasheet.ciiva.com/48531/aoa0000ce2-48531067.pdf; ComponentLink9Description: https://datasheet.ciiva.com/48531/aoa0000ce2-48531067.pdf; ComponentLink10URL: https://datasheet.ciiva.com/17207/aoa0000ce2-17207980.pdf; ComponentLink10Description: https://datasheet.ciiva.com/17207/aoa0000ce2-17207980.pdf; ComponentLink11URL: https://datasheet.ciiva.com/7830/426256-7830973.pdf; ComponentLink11Description: https://datasheet.ciiva.com/7830/426256-7830973.pdf; ComponentLink12URL: https://datasheet.ciiva.com/16522/aoa0000ce2-16522621.pdf; ComponentLink12Description: https://datasheet.ciiva.com/16522/aoa0000ce2-16522621.pdf; ComponentLink13URL: https://datasheet.ciiva.com/28514/1678782-28514175.pdf; ComponentLink13Description: https://datasheet.ciiva.com/28514/1678782-28514175.pdf
R72 = Res 0805: Resistor; Manufacturer: Panasonic; Manufacturer Part Number: ERJ-2RKF1023X; Description1: Res Thick Film 0402 102K Ohm 1% 0.1W(1/10W) ±100ppm/C Molded SMD Automotive T/R; Temperature Coefficient: ± 100ppm/°C; Voltage Rating: 50V; SVHC: To Be Advised; Product Range: PANASONIC - ERJ Series; Power Rating: 100mW; Resistance Tolerance: ± 1%; Resistor Case Style: 0402 ^1005 Metric]; Resistor Element Type: Thick Film; Supplier 1: Digi-Key; Supplier Part Number 1: P102KLCT-ND; Stock 1: 276077; Pricing 1: 1=0.1, 10=0.056, 100=0.0227, 1000=0.0102, 2500=0.0089, 5000=0.0073 (USD); Packaging: Full Reel; ComponentLink1URL: https://datasheet.ciiva.com/16763/70260748-16763080.pdf; ComponentLink1Description: https://datasheet.ciiva.com/16763/70260748-16763080.pdf; ComponentLink2URL: https://datasheet.ciiva.com/43467/1678782-43467481.pdf; ComponentLink2Description: https://datasheet.ciiva.com/43467/1678782-43467481.pdf; ComponentLink3URL: https://datasheet.ciiva.com/9119/aoa0000ce2-9119242.pdf; ComponentLink3Description: https://datasheet.ciiva.com/9119/aoa0000ce2-9119242.pdf; ComponentLink4URL: https://datasheet.ciiva.com/7712/1678782-7712798.pdf; ComponentLink4Description: https://datasheet.ciiva.com/7712/1678782-7712798.pdf; ComponentLink5URL: https://datasheet.ciiva.com/16781/70260748-16781503.pdf; ComponentLink5Description: https://datasheet.ciiva.com/16781/70260748-16781503.pdf; ComponentLink6URL: https://datasheet.ciiva.com/22673/1678782-22673487.pdf; ComponentLink6Description: https://datasheet.ciiva.com/22673/1678782-22673487.pdf; ComponentLink7URL: https://datasheet.ciiva.com/46373/1678782-46373215.pdf; ComponentLink7Description: https://datasheet.ciiva.com/46373/1678782-46373215.pdf
R73 = Res 0805: Resistor; Manufacturer: Panasonic; Manufacturer Part Number: ERJ-3EKF1102V; Description1: PANASONIC ELECTRONIC COMPONENTS         ERJ3EKF1102V             SMD Chip Resistor, Thick Film, 11 kohm, 75 V, 0603 [1608 Metric], 100 mW,  1%, ERJ3E Series; Resistor Element Type: Thick Film; Product Range: PANASONIC - ERJ Series; Power Rating: 100mW; Resistance Tolerance: ± 1%; Resistor Case Style: 0603 [1608 Metric]; Temperature Coefficient: ± 100ppm/°C; Voltage Rating: 75V; SVHC: Diboron trioxide (19-Dec-2012); Resistor Mounting: SMD; SVHC (Secondary): Lead monoxide (lead oxide) (19-Dec-2012); Supplier 1: Digi-Key; Supplier Part Number 1: P11.0KHCT-ND; Stock 1: 832990; Pricing 1: 1=0.1, 10=0.079, 100=0.0323, 1000=0.0145, 2500=0.0126 (USD); Resistor Element Material: Thick Film; Packaging: Cut Tape; MSL: (Not Applicable); ComponentLink1URL: https://datasheet.ciiva.com/28676/1678782-28676965.pdf; ComponentLink1Description: https://datasheet.ciiva.com/28676/1678782-28676965.pdf; ComponentLink2URL: https://datasheet.ciiva.com/24069/aoa0000ce2-24069096.pdf; ComponentLink2Description: https://datasheet.ciiva.com/24069/aoa0000ce2-24069096.pdf; ComponentLink3URL: https://datasheet.ciiva.com/28577/1678782-28577723.pdf; ComponentLink3Description: https://datasheet.ciiva.com/28577/1678782-28577723.pdf; ComponentLink4URL: https://datasheet.ciiva.com/46387/426256-46387019.pdf; ComponentLink4Description: https://datasheet.ciiva.com/46387/426256-46387019.pdf; ComponentLink5URL: https://datasheet.ciiva.com/9193/aoa0000ce2-9193884.pdf; ComponentLink5Description: https://datasheet.ciiva.com/9193/aoa0000ce2-9193884.pdf; ComponentLink6URL: https://datasheet.ciiva.com/15158/getdatasheetpartid-247528-15158908.pdf; ComponentLink6Description: https://datasheet.ciiva.com/15158/getdatasheetpartid-247528-15158908.pdf; ComponentLink7URL: https://datasheet.ciiva.com/16780/70260748-16780829.pdf; ComponentLink7Description: https://datasheet.ciiva.com/16780/70260748-16780829.pdf; ComponentLink8URL: https://datasheet.ciiva.com/46374/426256-46374157.pdf; ComponentLink8Description: https://datasheet.ciiva.com/46374/426256-46374157.pdf; ComponentLink9URL: https://datasheet.ciiva.com/43460/426256-43460542.pdf; ComponentLink9Description: https://datasheet.ciiva.com/43460/426256-43460542.pdf
R74 = Res 0805: Resistor; Manufacturer: Panasonic; Manufacturer Part Number: ERJ-2LWFR010X; Description1: RES SMD 0.01 OHM 1% 1/5W 0402; Tolerance: ±1%; Power (Watts): 0.2W, 1/5W; Temperature Coefficient: 0/ +500ppm/°C; Supplier 1: Digi-Key; Supplier Part Number 1: P19181DKR-ND; Stock 1: 74980; Pricing 1: 1=0.39, 10=0.296, 25=0.2256, 50=0.1676, 100=0.1246, 250=0.1053, 500=0.0902, 1000=0.0688, 5000=0.058 (USD); Category: Resistors; Family: Chip Resistor - Surface Mount; Series: ERJ; Packaging: Cut Tape (CT); Composition: Thick Film; Features: Automotive AEC-Q200, Current Sense; Operating Temperature: -55°C ~ 125°C; Package / Case: 0402 (1005 Metric); Supplier Device Package: 0402; Size / Dimension: 0.039" L x 0.020" W (1.00mm x 0.50mm); Height: 0.018" (0.45mm); Number of Terminations: 2; ComponentLink1URL: https://industrial.panasonic.com/cdbs/www-data/pdf/RDN0000/AOA0000C313.pdf; ComponentLink1Description: https://industrial.panasonic.com/cdbs/www-data/pdf/RDN0000/AOA0000C313.pdf
R75 = Res 0805: Resistor; Manufacturer: Panasonic; Manufacturer Part Number: ERJ-2RKF3300X; Description1: Res Thick Film 0402 330 Ohm 1% 0.1W(1/10W) ±100ppm/C Molded SMD Automotive Punched T/R; Resistor Element Type: Thick Film; Product Range: PANASONIC - ERJ Series; Power Rating: 100mW; Resistance Tolerance: ± 1%; Resistor Case Style: 0402 [1005 Metric]; Temperature Coefficient: ± 100ppm/°C; Voltage Rating: 50V; SVHC: Diboron trioxide (19-Dec-2012); Resistor Mounting: SMD; Resistor Terminals: Wraparound; SVHC (Secondary): Lead monoxide (lead oxide) (19-Dec-2012); Supplier 1: Digi-Key; Supplier Part Number 1: P330LCT-ND; Stock 1: 634394; Pricing 1: 1=0.1, 10=0.056, 100=0.0227, 1000=0.0102, 2500=0.0089, 5000=0.0073 (USD); Resistor Element Material: Thick Film; Packaging: Cut Tape; MSL: (Not Applicable); ComponentLink1URL: https://datasheet.ciiva.com/11821/0900766b80f80784-11821296.pdf; ComponentLink1Description: https://datasheet.ciiva.com/11821/0900766b80f80784-11821296.pdf; ComponentLink2URL: https://datasheet.ciiva.com/16765/70260748-16765702.pdf; ComponentLink2Description: https://datasheet.ciiva.com/16765/70260748-16765702.pdf; ComponentLink3URL: https://datasheet.ciiva.com/17206/aoa0000ce2-17206150.pdf; ComponentLink3Description: https://datasheet.ciiva.com/17206/aoa0000ce2-17206150.pdf; ComponentLink4URL: https://datasheet.ciiva.com/30088/aoa0000ce2-30088246.pdf; ComponentLink4Description: https://datasheet.ciiva.com/30088/aoa0000ce2-30088246.pdf; ComponentLink5URL: https://datasheet.ciiva.com/6138/aoa0000ce2-6138743.pdf; ComponentLink5Description: https://datasheet.ciiva.com/6138/aoa0000ce2-6138743.pdf; ComponentLink6URL: https://datasheet.ciiva.com/46373/1678782-46373913.pdf; ComponentLink6Description: https://datasheet.ciiva.com/46373/1678782-46373913.pdf; ComponentLink7URL: https://datasheet.ciiva.com/7887/aoa0000ce2-7887018.pdf; ComponentLink7Description: https://datasheet.ciiva.com/7887/aoa0000ce2-7887018.pdf; ComponentLink8URL: https://datasheet.ciiva.com/46373/1678782-46373914.pdf; ComponentLink8Description: https://datasheet.ciiva.com/46373/1678782-46373914.pdf; ComponentLink9URL: https://datasheet.ciiva.com/16426/aoa0000ce2-16426749.pdf; ComponentLink9Description: https://datasheet.ciiva.com/16426/aoa0000ce2-16426749.pdf; ComponentLink10URL: https://datasheet.ciiva.com/7886/aoa0000ce2-7886718.pdf; ComponentLink10Description: https://datasheet.ciiva.com/7886/aoa0000ce2-7886718.pdf; ComponentLink11URL: https://datasheet.ciiva.com/22706/1678782-22706926.pdf; ComponentLink11Description: https://datasheet.ciiva.com/22706/1678782-22706926.pdf
R76 = Res 0805: Resistor; Manufacturer: Samsung; Manufacturer Part Number: RC1005F472CS; Description1: Res Thick Film 0402 4.7K Ohm 1% 1/16W ±100ppm/C Molded SMD T/R; Tolerance: 1 %; Power Rating: 1/16 W; Case Style: Molded; Temperature Coefficient: ±100 ppm/°C; Rad Hard: No; Lead Finish: Tin; Supplier 1: Digi-Key; Supplier Part Number 1: 1276-3466-1-ND; Stock 1: 3257499; Pricing 1: 1=0.1, 10=0.021, 100=0.0087, 1000=0.0039, 2500=0.0034, 5000=0.0028 (USD); Case Size: 0402; Packaging: Tape & Reel; Type: Thick Film; Operating Temperature: -55 to 155 °C; ComponentLink1URL: https://datasheet.ciiva.com/15196/getdatasheetpartid-636616-15196228.pdf; ComponentLink1Description: https://datasheet.ciiva.com/15196/getdatasheetpartid-636616-15196228.pdf; ComponentLink2URL: https://datasheet.ciiva.com/26185/chip-resistor-150112-1-26185621.pdf; ComponentLink2Description: https://datasheet.ciiva.com/26185/chip-resistor-150112-1-26185621.pdf
R77 = Res 0805: Resistor; Manufacturer: Panasonic; Manufacturer Part Number: ERJ-2RKF1203X; Description1: Panasonic ERJ2RK Series Thick Film Surface Mount Fixed Resistor 0402 Case 120k 1% 0.1W 100ppm/C; Resistor Element Type: Thick Film; Product Range: PANASONIC - ERJ Series; Power Rating: 100mW; Resistance Tolerance: ± 1%; Resistor Case Style: 0402 [1005 Metric]; Temperature Coefficient: ± 100ppm/°C; Voltage Rating: 50V; SVHC: Diboron trioxide (19-Dec-2012); Resistor Mounting: SMD; Resistor Terminals: Wraparound; SVHC (Secondary): Lead monoxide (lead oxide) (19-Dec-2012); Supplier 1: Digi-Key; Supplier Part Number 1: P120KLCT-ND; Stock 1: 638792; Pricing 1: 1=0.1, 10=0.056, 100=0.0227, 1000=0.0102, 2500=0.0089, 5000=0.0073 (USD); Resistor Element Material: Thick Film; Packaging: Cut Tape; MSL: (Not Applicable); ComponentLink1URL: https://datasheet.ciiva.com/22682/1678782-22682165.pdf; ComponentLink1Description: https://datasheet.ciiva.com/22682/1678782-22682165.pdf; ComponentLink2URL: https://datasheet.ciiva.com/16760/70260748-16760006.pdf; ComponentLink2Description: https://datasheet.ciiva.com/16760/70260748-16760006.pdf; ComponentLink3URL: https://datasheet.ciiva.com/11821/0900766b80f80784-11821159.pdf; ComponentLink3Description: https://datasheet.ciiva.com/11821/0900766b80f80784-11821159.pdf; ComponentLink4URL: https://datasheet.ciiva.com/5915/aoa0000ce2-5915274.pdf; ComponentLink4Description: https://datasheet.ciiva.com/5915/aoa0000ce2-5915274.pdf; ComponentLink5URL: https://datasheet.ciiva.com/16782/70260748-16782650.pdf; ComponentLink5Description: https://datasheet.ciiva.com/16782/70260748-16782650.pdf; ComponentLink6URL: https://datasheet.ciiva.com/43467/1678782-43467486.pdf; ComponentLink6Description: https://datasheet.ciiva.com/43467/1678782-43467486.pdf